# Altium project ADC_1.PrjPCB
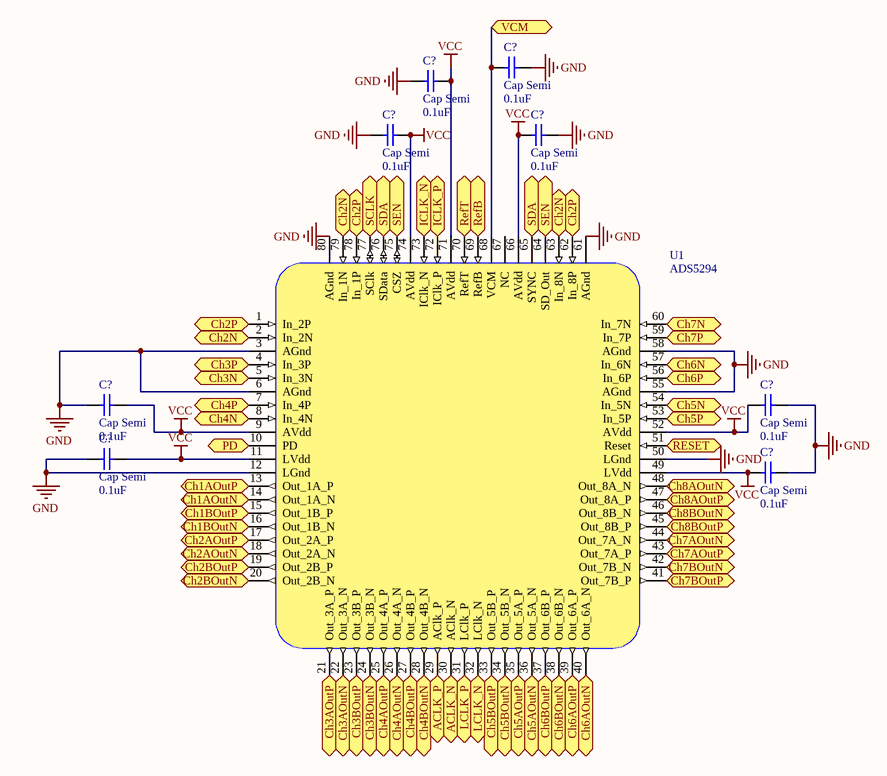
[diagram p0: ADC_1.SchDoc]
1 sheet, 9 parts. Net scope: flat (ports and power ports of the same name join across sheets).

## Sheet ADC_1.SchDoc
size A4

### Parts
(Parts that share a designator on the sheet are numbered #1, #2 ... from top to bottom, then left to right.)
C?#1  Cap Semi  value 0.1uF  [1608[0603]]
C?#2  Cap Semi  value 0.1uF  [1608[0603]]
C?#3  Cap Semi  value 0.1uF  [1608[0603]]
C?#4  Cap Semi  value 0.1uF  [1608[0603]]
C?#5  Cap Semi  value 0.1uF  [1608[0603]]
C?#6  Cap Semi  value 0.1uF  [1608[0603]]
C?#7  Cap Semi  value 0.1uF  [1608[0603]]
C?#8  Cap Semi  value 0.1uF  [1608[0603]]
U1  ADS5294  [PFP80_M]

### Ports
ACLK_N, ACLK_P, Ch1AOutN, Ch1AOutP, Ch1BOutN, Ch1BOutP, Ch2AOutN, Ch2AOutP, Ch2BOutN, Ch2BOutP, Ch2N, Ch2P, Ch3AOutN, Ch3AOutP, Ch3BOutN, Ch3BOutP, Ch3N, Ch3P, Ch4AOutN, Ch4AOutP, Ch4BOutN, Ch4BOutP, Ch4N, Ch4P, Ch5AOutN, Ch5AOutP, Ch5BOutN, Ch5BOutP, Ch5N, Ch5P, Ch6AOutN, Ch6AOutP, Ch6BOutN, Ch6BOutP, Ch6N, Ch6P, Ch7AOutN, Ch7AOutP, Ch7BOutN, Ch7BOutP, Ch7N, Ch7P, Ch8AOutN, Ch8AOutP, Ch8BOutN, Ch8BOutP, ICLK_N, ICLK_P, LCLK_N, LCLK_P, PD, RefB, RefT, RESET, SCLK, SDA, SEN, VCM

### Nets
GND: C?#1.2 C?#2.2 C?#3.1 C?#4.2 C?#5.1 C?#6.2 C?#7.1 C?#8.2 U1.3(AGnd) U1.6(AGnd) U1.12(LGnd) U1.50(LGnd) U1.55(AGnd) U1.58(AGnd) U1.61(AGnd) U1.80(AGnd)
VCC: C?#2.1 C?#3.2 C?#4.1 C?#5.2 C?#6.1 C?#7.2 C?#8.1 U1.9(AVdd) U1.11(LVdd) U1.49(LVdd) U1.52(AVdd) U1.66(AVdd) U1.71(AVdd) U1.74(AVdd)
NetC?#1_1: C?#1.1 U1.68(VCM) ; port VCM
NetU1_1: U1.1(In_2P) U1.62(In_8P) U1.78(In_1P) ; port Ch2P
NetU1_2: U1.2(In_2N) U1.63(In_8N) U1.79(In_1N) ; port Ch2N
NetU1_4: U1.4(In_3P) ; port Ch3P
NetU1_5: U1.5(In_3N) ; port Ch3N
NetU1_7: U1.7(In_4P) ; port Ch4P
NetU1_8: U1.8(In_4N) ; port Ch4N
NetU1_10: U1.10(PD) ; port PD
NetU1_13: U1.13(Out_1A_P) ; port Ch1AOutP
NetU1_14: U1.14(Out_1A_N) ; port Ch1AOutN
NetU1_15: U1.15(Out_1B_P) ; port Ch1BOutP
NetU1_16: U1.16(Out_1B_N) ; port Ch1BOutN
NetU1_17: U1.17(Out_2A_P) ; port Ch2AOutP
NetU1_18: U1.18(Out_2A_N) ; port Ch2AOutN
NetU1_19: U1.19(Out_2B_P) ; port Ch2BOutP
NetU1_20: U1.20(Out_2B_N) ; port Ch2BOutN
NetU1_21: U1.21(Out_3A_P) ; port Ch3AOutP
NetU1_22: U1.22(Out_3A_N) ; port Ch3AOutN
NetU1_23: U1.23(Out_3B_P) ; port Ch3BOutP
NetU1_24: U1.24(Out_3B_N) ; port Ch3BOutN
NetU1_25: U1.25(Out_4A_P) ; port Ch4AOutP
NetU1_26: U1.26(Out_4A_N) ; port Ch4AOutN
NetU1_27: U1.27(Out_4B_P) ; port Ch4BOutP
NetU1_28: U1.28(Out_4B_N) ; port Ch4BOutN
NetU1_29: U1.29(AClk_P) ; port ACLK_P
NetU1_30: U1.30(AClk_N) ; port ACLK_N
NetU1_31: U1.31(LClk_P) ; port LCLK_P
NetU1_32: U1.32(LClk_N) ; port LCLK_N
NetU1_33: U1.33(Out_5B_P) ; port Ch5BOutP
NetU1_34: U1.34(Out_5B_N) ; port Ch5BOutN
NetU1_35: U1.35(Out_5A_P) ; port Ch5AOutP
NetU1_36: U1.36(Out_5A_N) ; port Ch5AOutN
NetU1_37: U1.37(Out_6B_P) ; port Ch6BOutP
NetU1_38: U1.38(Out_6B_N) ; port Ch6BOutN
NetU1_39: U1.39(Out_6A_P) ; port Ch6AOutP
NetU1_40: U1.40(Out_6A_N) ; port Ch6AOutN
NetU1_41: U1.41(Out_7B_P) ; port Ch7BOutP
NetU1_42: U1.42(Out_7B_N) ; port Ch7BOutN
NetU1_43: U1.43(Out_7A_P) ; port Ch7AOutP
NetU1_44: U1.44(Out_7A_N) ; port Ch7AOutN
NetU1_45: U1.45(Out_8B_P) ; port Ch8BOutP
NetU1_46: U1.46(Out_8B_N) ; port Ch8BOutN
NetU1_47: U1.47(Out_8A_P) ; port Ch8AOutP
NetU1_48: U1.48(Out_8A_N) ; port Ch8AOutN
NetU1_51: U1.51(Reset) ; port RESET
NetU1_53: U1.53(In_5P) ; port Ch5P
NetU1_54: U1.54(In_5N) ; port Ch5N
NetU1_56: U1.56(In_6P) ; port Ch6P
NetU1_57: U1.57(In_6N) ; port Ch6N
NetU1_59: U1.59(In_7P) ; port Ch7P
NetU1_60: U1.60(In_7N) ; port Ch7N
NetU1_64: U1.64(SD_Out) U1.75(CSZ) ; port SEN
NetU1_65: U1.65(SYNC) U1.76(SData) ; port SDA
NetU1_69: U1.69(RefB) ; port RefB
NetU1_70: U1.70(RefT) ; port RefT
NetU1_72: U1.72(IClk_P) ; port ICLK_P
NetU1_73: U1.73(IClk_N) ; port ICLK_N
NetU1_77: U1.77(SClk) ; port SCLK

Not connected (* = marked no-connect by the designer): U1 67(NC)

### Library data of the parts
C?#1-C?#8 = Cap Semi: Capacitor (Semiconductor SIM Model); Published: 8-Jun-2000; LatestRevisionDate: 29-May-2009; LatestRevisionNote: IPC-7351 Footprint Added.; PackageReference: C1206; Publisher: Altium Limited; PackageDescription: Chip Capacitor